# EAGLE design Rev4 (EAGLE 7.4.0)
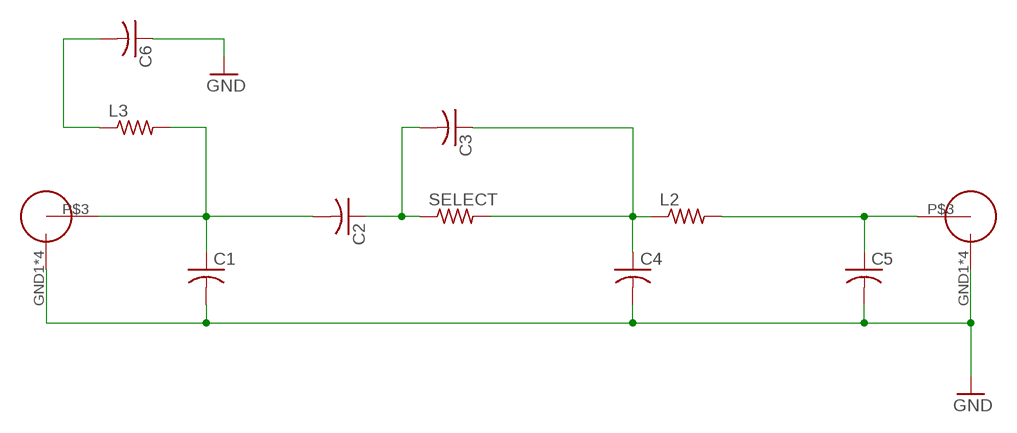
[diagram p0: schematic, sheet 1]

## Parts
C1  C-USC0603  [C0603]
C2  C-USC0603  [C0603]
C3  C-USC0603  [C0603]
C4  C-USC0603  [C0603]
C5  C-USC0603  [C0603]
C6  C-USC0603  [C0603]
L2  R-US_R0603  [R0603]
L3  R-US_R0603  [R0603]
SELECT  R-US_R0603  [R0603]
U$1  SMAJ716-ND  [SMAJ716-ND]
U$2  SMAJ716-ND  [SMAJ716-ND]

## Nets
C3: C3.1 C4.1 L2.1 SELECT.2
GND: C1.2 C4.2 C5.2 C6.1 U$1.GND1(OUTERCONDUCTOR) U$1.GND2(OUTERCONDUCTOR) U$1.GND3(OUTERCONDUCTOR) U$1.GND4(OUTERCONDUCTOR) U$2.GND1(OUTERCONDUCTOR) U$2.GND2(OUTERCONDUCTOR) U$2.GND3(OUTERCONDUCTOR) U$2.GND4(OUTERCONDUCTOR)
N$1: C6.2 L3.1
N$5: C5.1 L2.2 U$2.P$3(CENTERCONDUCTOR)
N$7: C2.1 C3.2 SELECT.1
N$9: C1.1 C2.2 L3.2 U$1.P$3(CENTERCONDUCTOR)

## Library data of the parts
C1-C6 = adafruit:C-US: CAPACITOR, American symbol
L2 L3 SELECT = adafruit:R-US_: RESISTOR, American symbol
U$1 U$2 = SMAJ16-ND:SMAJ716-ND

## Net classes
0 default: width 1.422 mm, drill 0.508 mm, clearance 1.016 mm

## Board
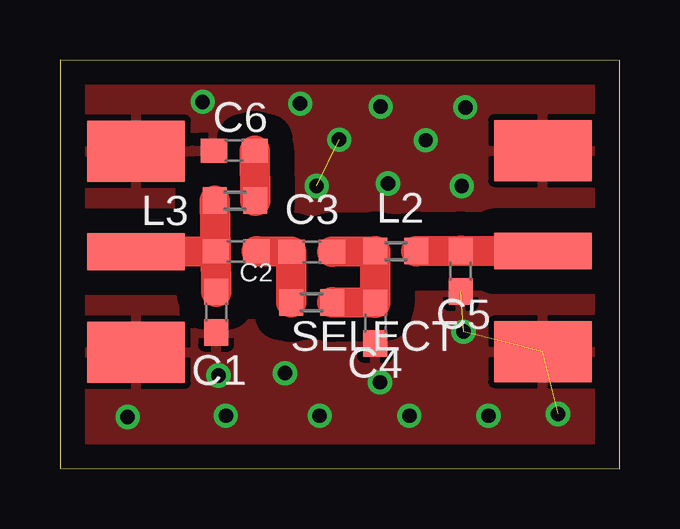
[diagram p1: board, top side]
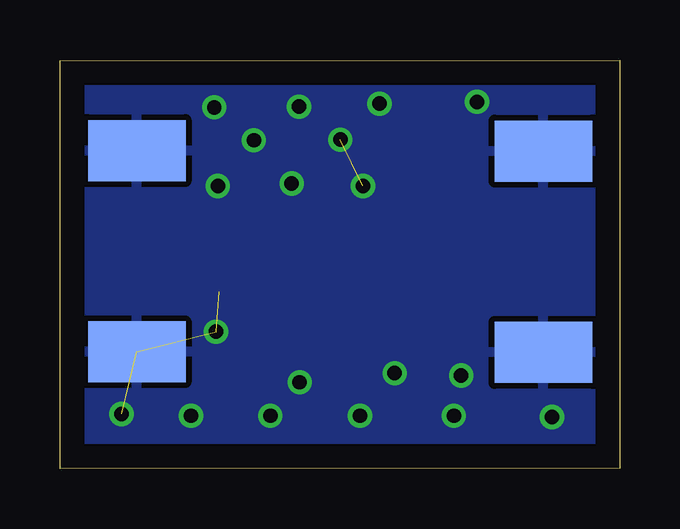
[diagram p2: board, bottom side, seen from below]

Size 23.32 x 17.03 mm. Coordinates in mm from the lower left corner, seen from the top.
Outline: 0,0.03 23.32,0 23.32,17.01 0,17.03 0,0.03
Copper layers (1*16): Top 0.035mm / dielectric 1.5mm / Bottom 0.035mm
Design rules "default": minimum track width 10mil, minimum drill 24mil, track to track 8mil, track to pad 8mil, pad to pad 8mil, via to via 8mil, smd to smd 8mil, copper to edge 40mil, drill to drill 8mil, minimum pad ring 10mil, minimum via ring 8mil, stop-mask expansion 4mil, vias tented up to drill 0mil, thermal gap 10mil

### Footprints (pad centres in the part's own frame; a part is rotated, then mirrored left to right if it is on the bottom)
C0603 = smd 1.1 x 1: 1 -0.85,0; 2 0.85,0
R0603 = smd 1 x 1.1: 1 -0.85,0; 2 0.85,0
SMAJ716-ND = smd 2.54 x 4.064 bottom: GND1 4.191,0.508; GND3 -4.191,0.508 | smd 2.54 x 4.064: GND2 -4.191,0.508; GND4 4.191,0.508 | smd 1.524 x 4.064: P$3 0,0.508

### Placement (x,y rotation side)
C1  6.5,6.53 270 top
C2  7.34,9.07 180 top
C3  10.49,9.04 180 top
C4  13.13,6.07 270 top
C5  16.69,8.23 270 top
C6  7.26,13.26 0 top
L2  14,9.07 0 top
L3  7.29,11.18 180 top
SELECT  10.49,6.93 0 top
U$1  3.68,9.04 90 top
U$2  19.61,9.07 270 top

### Tracks (layer width: path | path; a pad name or v marks a point on that pad's centre or on a via)
C3
  Top 1.27: C3.1 L2.1 C4.1 SELECT.2
GND  (via drill 0.6)  (5 unrouted)
  other vias: 6.6,3.89 15.24,13.69 6.91,2.21 11.63,13.72 2.82,2.16 10.01,15.21 16.89,15.06 13.36,15.09 13.33,3.61 16.74,11.79 14.55,2.21 13.67,11.89 10.82,2.21 9.37,3.99 17.86,2.21 5.94,15.29 16.81,5.71 10.69,11.79 20.75,2.29
  pour Top: -0.2,-0.28 23.55,-0.36 23.49,17.07 -0.3,17.17
  pour Bottom: 0.1,17.22 23.22,16.97 23.27,-0.51 0.15,-0.25
N$1
  Top 1.27: C6.2 L3.1
N$5
  Top 1.27: L2.2 C5.1 U$2.P$3
N$7
  Top 1.27: C2.1 C3.2 SELECT.1
N$9
  Top 1.27: U$1.P$3 C2.2 | C2.2 L3.2 | C1.1 C2.2